# EAGLE design Low_Voltage_Solar_Controller_V1.1 (EAGLE 9.6.2)
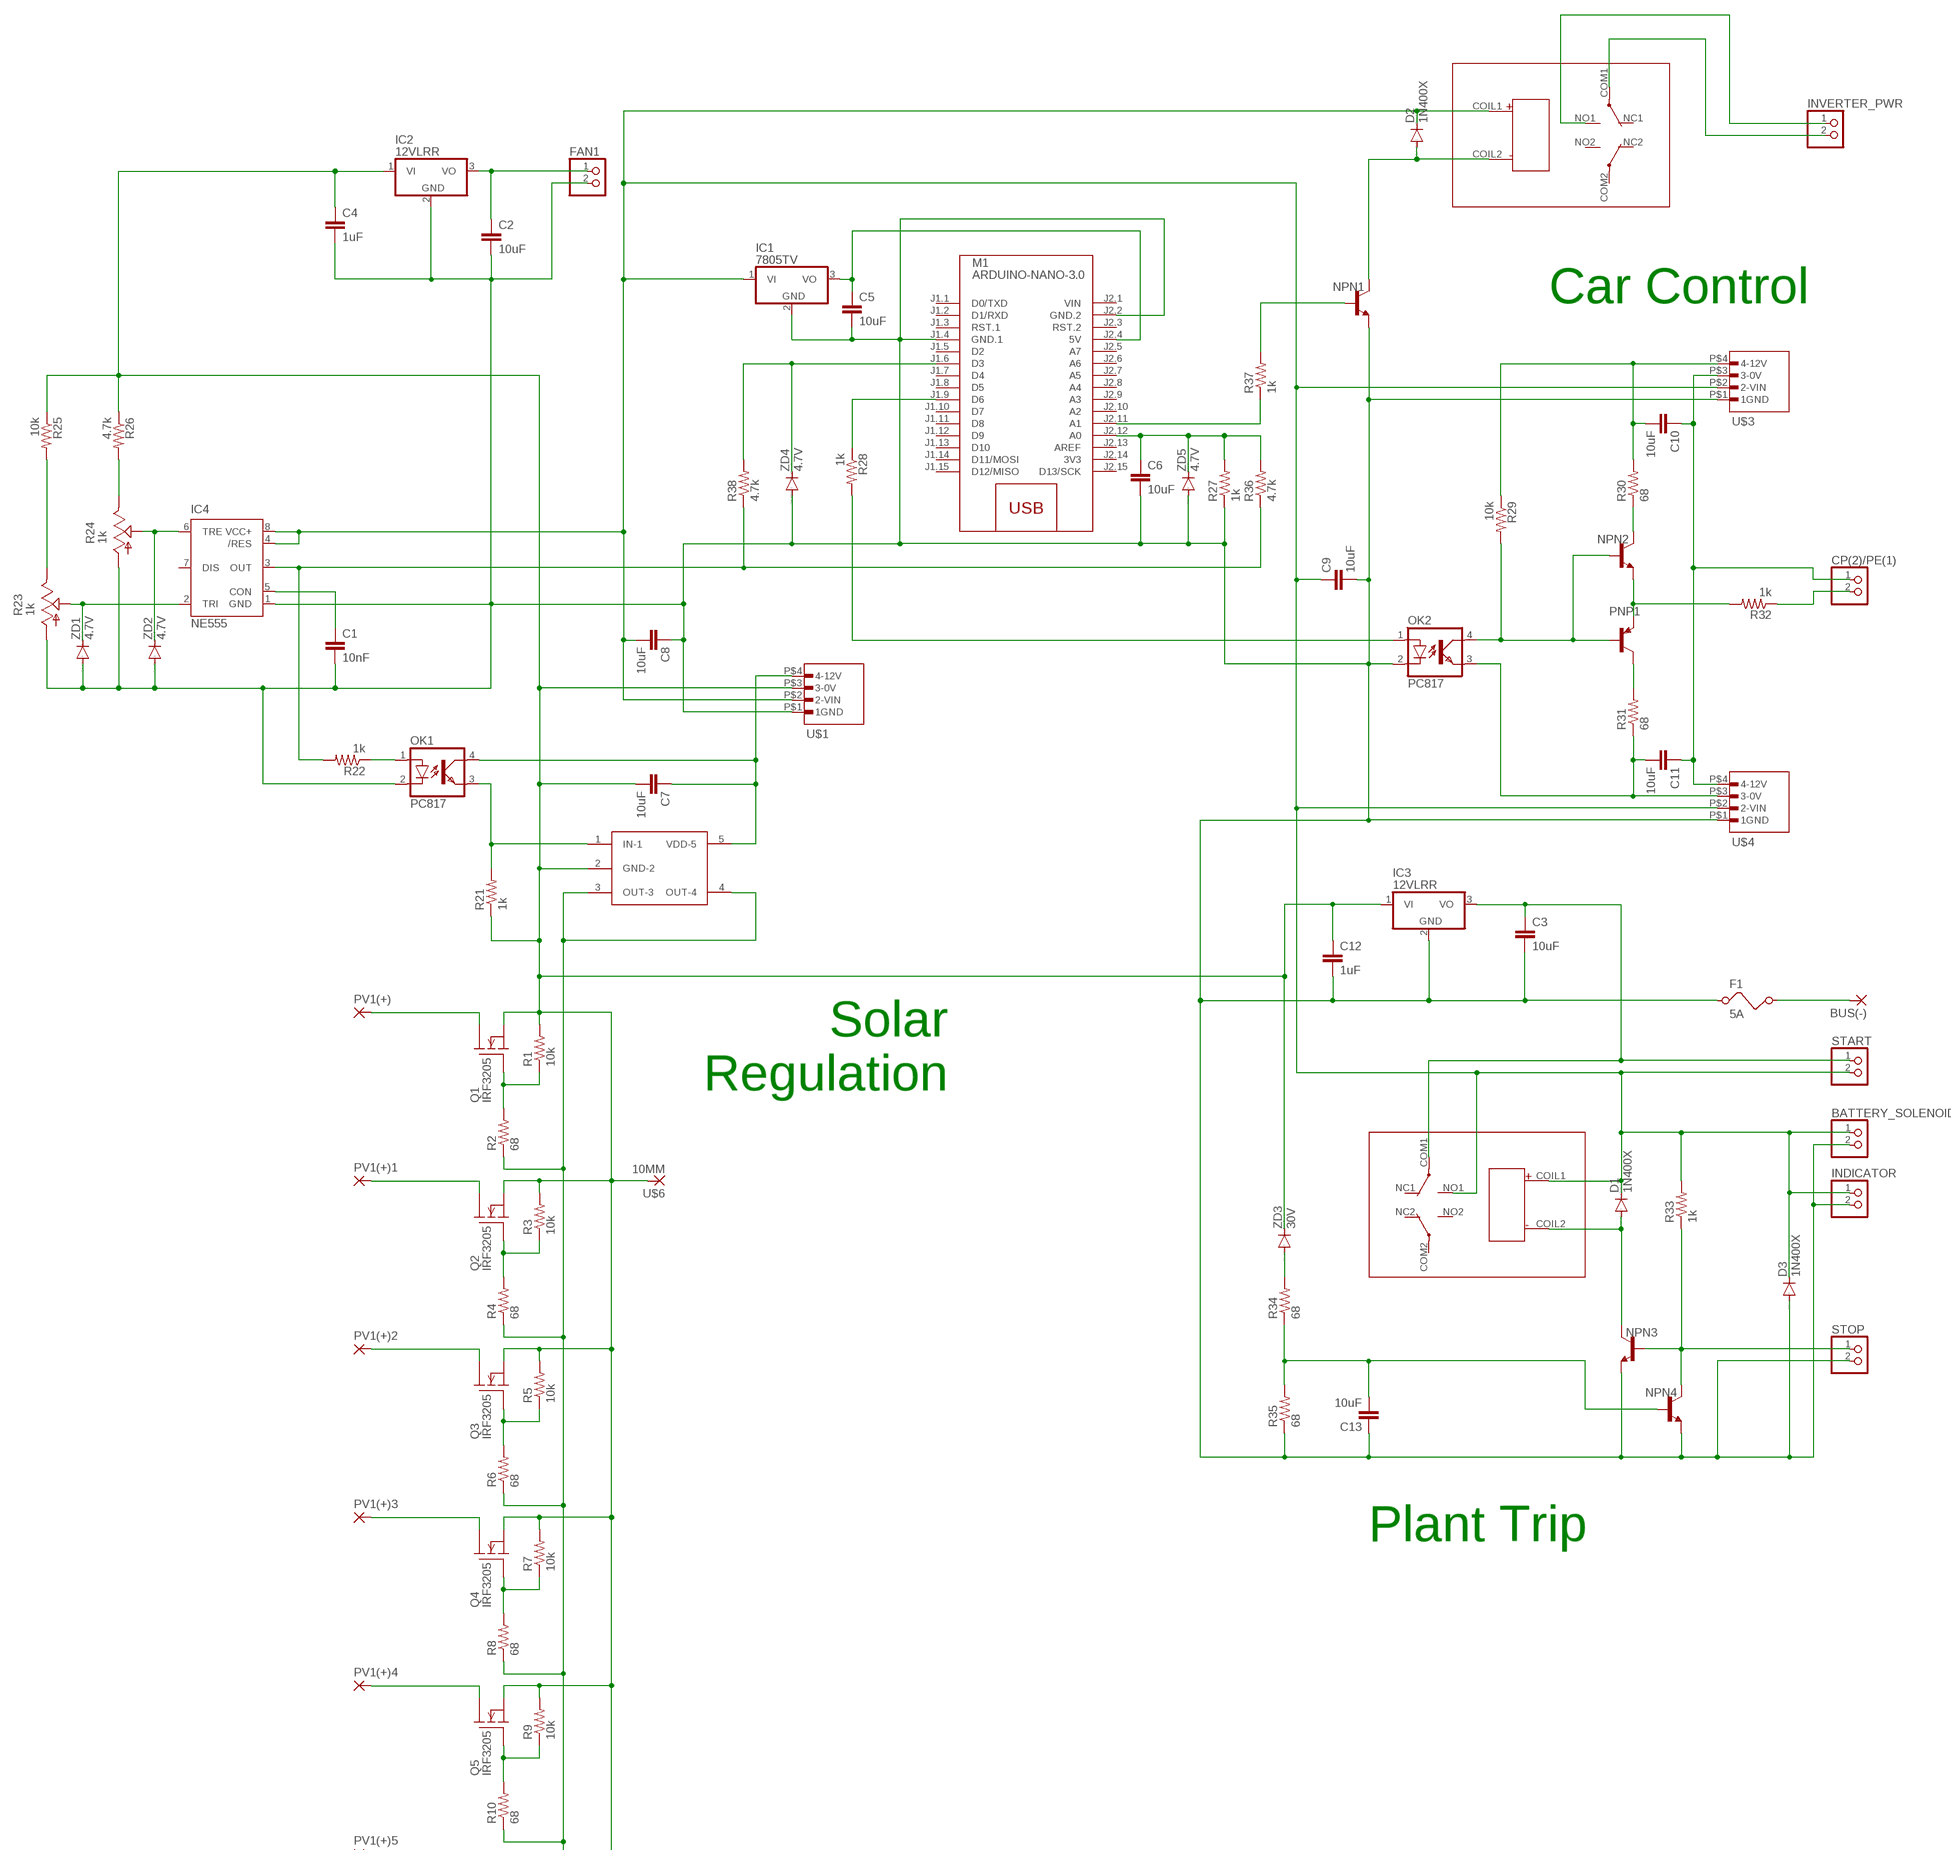
[diagram p0: schematic, sheet 1, part 1 of 2]
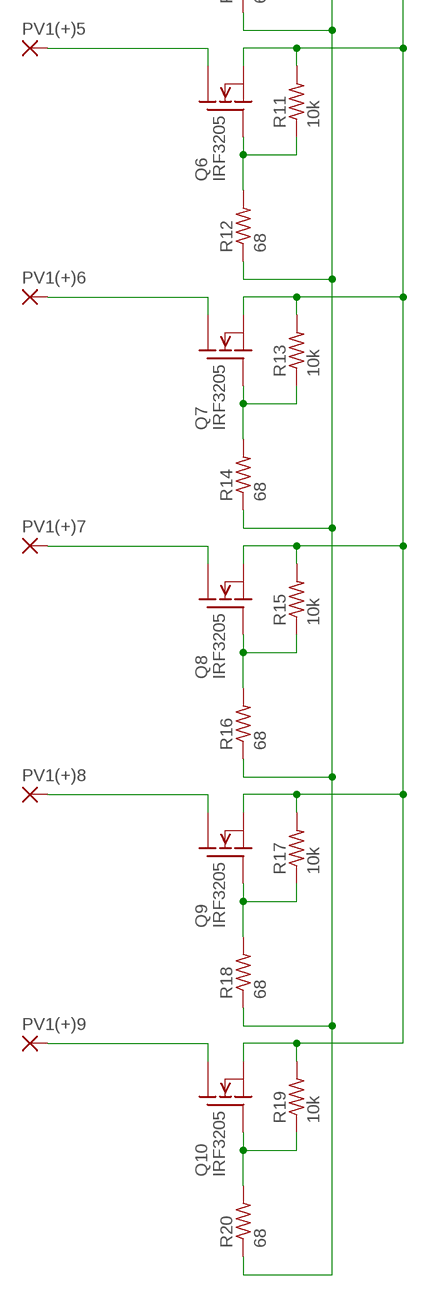
[diagram p1: schematic, sheet 1, part 2 of 2]

## Parts
BATTERY_SOLENOID  PINHD-1X2  [1X02]
BUS(-)  5MM_PAD  [5MM]
C1  10nF  C-EUC0603  [C0603]
C2  10uF  C-EUC0805  [C0805]
C3  10uF  C-EUC0805  [C0805]
C4  1uF  C-EUC0805  [C0805]
C5  10uF  C-EUC0805  [C0805]
C6  10uF  C-EUC0805  [C0805]
C7  10uF  C-EUC0805  [C0805]
C8  10uF  C-EUC0805  [C0805]
C9  10uF  C-EUC0805  [C0805]
C10  10uF  C-EUC0805  [C0805]
C11  10uF  C-EUC0805  [C0805]
C12  1uF  C-EUC0805  [C0805]
C13  10uF  C-EUC0805  [C0805]
CP(2)/PE(1)  PINHD-1X2  [1X02]
D1  1N400X  1N4004  [DO41-10]
D2  1N400X  1N4004  [DO41-10]
D3  1N400X  1N4004  [DO41-10]
F1  5A  FUSE_HOLDER  [FUSE_HOLDER]
FAN1  PINHD-1X2  [1X02]
IC1  7805TV  [TO220V]
IC2  12VLRR  7805TV  [TO220V]
IC3  12VLRR  7805TV  [TO220V]
IC4  NE555  [DIL-08]
INDICATOR  PINHD-1X2  [1X02]
INVERTER_PWR  PINHD-1X2  [1X02]
M1  ARDUINO-NANO-3.0  [ARDUINO-NANO-3.0]
NPN1  -NPN-TO92-EBC  [TO92-EBC]
NPN2  -NPN-TO92-EBC  [TO92-EBC]
NPN3  -NPN-TO92-EBC  [TO92-EBC]
NPN4  -NPN-TO92-EBC  [TO92-EBC]
OK1  PC817  [DIL04]
OK2  PC817  [DIL04]
PNP1  BCX58-PNP-TO92-EBC  [TO92-EBC]
PV1(+)  5MM_PAD  [5MM]
PV1(+)1  5MM_PAD  [5MM]
PV1(+)2  5MM_PAD  [5MM]
PV1(+)3  5MM_PAD  [5MM]
PV1(+)4  5MM_PAD  [5MM]
PV1(+)5  5MM_PAD  [5MM]
PV1(+)6  5MM_PAD  [5MM]
PV1(+)7  5MM_PAD  [5MM]
PV1(+)8  5MM_PAD  [5MM]
PV1(+)9  5MM_PAD  [5MM]
Q1  IRF3205  BUZ11  [TO220]
Q2  IRF3205  BUZ11  [TO220]
Q3  IRF3205  BUZ11  [TO220]
Q4  IRF3205  BUZ11  [TO220]
Q5  IRF3205  BUZ11  [TO220]
Q6  IRF3205  BUZ11  [TO220]
Q7  IRF3205  BUZ11  [TO220]
Q8  IRF3205  BUZ11  [TO220]
Q9  IRF3205  BUZ11  [TO220]
Q10  IRF3205  BUZ11  [TO220]
R1  10k  R-US_R0805  [R0805]
R2  68  R-US_R0805  [R0805]
R3  10k  R-US_R0805  [R0805]
R4  68  R-US_R0805  [R0805]
R5  10k  R-US_R0805  [R0805]
R6  68  R-US_R0805  [R0805]
R7  10k  R-US_R0805  [R0805]
R8  68  R-US_R0805  [R0805]
R9  10k  R-US_R0805  [R0805]
R10  68  R-US_R0805  [R0805]
R11  10k  R-US_R0805  [R0805]
R12  68  R-US_R0805  [R0805]
R13  10k  R-US_R0805  [R0805]
R14  68  R-US_R0805  [R0805]
R15  10k  R-US_R0805  [R0805]
R16  68  R-US_R0805  [R0805]
R17  10k  R-US_R0805  [R0805]
R18  68  R-US_R0805  [R0805]
R19  10k  R-US_R0805  [R0805]
R20  68  R-US_R0805  [R0805]
R21  1k  R-US_R0805  [R0805]
R22  1k  R-US_R0805  [R0805]
R23  1k  TRIM_US-RJ9W  [RJ9W]
R24  1k  TRIM_US-RJ9W  [RJ9W]
R25  10k  R-US_R0805  [R0805]
R26  4.7k  R-US_R0805  [R0805]
R27  1k  R-US_R0805  [R0805]
R28  1k  R-US_R0805  [R0805]
R29  10k  R-US_R0805  [R0805]
R30  68  R-US_R0805  [R0805]
R31  68  R-US_R0805  [R0805]
R32  1k  R-US_R0805  [R0805]
R33  1k  R-US_R0805  [R0805]
R34  68  R-US_R0805  [R0805]
R35  68  R-US_R0805  [R0805]
R36  4.7k  R-US_R0805  [R0805]
R37  1k  R-US_R0805  [R0805]
R38  4.7k  R-US_R0805  [R0805]
START  PINHD-1X2  [1X02]
STOP  PINHD-1X2  [1X02]
U$1  IB0512S-W75R3  [IB0512S-W75R3]
U$2  NCP51100  [SOT23-5]
U$3  IB0512S-W75R3  [IB0512S-W75R3]
U$4  IB0512S-W75R3  [IB0512S-W75R3]
U$5  J104D2C12VDC.20S  [J104D2C12VDC.20S]
U$6  10MM  [10MM]
U$8  J104D2C12VDC.20S  [J104D2C12VDC.20S]
ZD1  4.7V  CGRM4001-G  [SOD-123_MINI-SMA]
ZD2  4.7V  CGRM4001-G  [SOD-123_MINI-SMA]
ZD3  30V  DIODE-DO214AA  [DO214AA]
ZD4  4.7V  CGRM4001-G  [SOD-123_MINI-SMA]
ZD5  4.7V  CGRM4001-G  [SOD-123_MINI-SMA]

## Nets
N$1: PV1(+).P$1(P) Q1.2(D)
N$2: C4.1 C7.2 C12.1 IC2.1(VI) IC3.1(VI) Q1.3(S) Q2.3(S) Q3.3(S) Q4.3(S) Q5.3(S) Q6.3(S) Q7.3(S) Q8.3(S) Q9.3(S) Q10.3(S) R1.2 R3.2 R5.2 R7.2 R9.2 R11.2 R13.2 R15.2 R17.2 R19.2 R21.1 R25.1 R26.1 U$1.P$3(3-0V) U$2.2(GND-2) U$6.P$1(P) ZD3.C
N$3: Q1.1(G) R1.1 R2.2
N$4: PV1(+)1.P$1(P) Q2.2(D)
N$5: M1.J1.6(D3) R38.2 ZD4.C
N$6: Q2.1(G) R3.1 R4.2
N$7: PV1(+)2.P$1(P) Q3.2(D)
N$9: Q3.1(G) R5.1 R6.2
N$10: PV1(+)3.P$1(P) Q4.2(D)
N$12: C5.1 IC1.3(VO) M1.J2.4(5V)
N$13: Q4.1(G) R7.1 R8.2
N$14: PV1(+)4.P$1(P) Q5.2(D)
N$16: Q5.1(G) R9.1 R10.2
N$17: PV1(+)5.P$1(P) Q6.2(D)
N$19: Q6.1(G) R11.1 R12.2
N$20: PV1(+)6.P$1(P) Q7.2(D)
N$22: Q7.1(G) R13.1 R14.2
N$23: PV1(+)7.P$1(P) Q8.2(D)
N$25: Q8.1(G) R15.1 R16.2
N$26: PV1(+)8.P$1(P) Q9.2(D)
N$28: Q9.1(G) R17.1 R18.2
N$29: PV1(+)9.P$1(P) Q10.2(D)
N$31: Q10.1(G) R19.1 R20.2
N$32: R2.1 R4.1 R6.1 R8.1 R10.1 R12.1 R14.1 R16.1 R18.1 R20.1 U$2.3(OUT-3) U$2.4(OUT-4)
N$33: OK1.3(EMIT) R21.2 U$2.1(IN-1)
N$34: C7.1 OK1.4(COL) U$1.P$4(4-12V) U$2.5(VDD-5)
N$36: BATTERY_SOLENOID.1 C8.2 C9.1 D1.C D2.C D3.C IC1.1(VI) IC4.4(/RES) IC4.8(VCC+) INDICATOR.1 R33.2 START.2 U$1.P$2(2-VIN) U$3.P$2(2-VIN) U$4.P$2(2-VIN) U$5.COIL1 U$8.COIL1 U$8.NO1
N$37: OK1.1(A) R22.1
N$38: BATTERY_SOLENOID.2 C1.2 C2.2 C3.2 C4.2 C5.2 C6.2 C8.1 C9.2 C12.2 C13.1 D3.A F1.P$1 F1.P$2 FAN1.2 IC1.2(GND) IC2.2(GND) IC3.2(GND) IC4.1(GND) INDICATOR.2 M1.J1.4(GND.1) M1.J2.2(GND.2) NPN1.E NPN3.E NPN4.E OK1.2(C) OK2.2(C) R23.A R24.A R27.1 R35.1 STOP.2 U$1.P$1(1GND) U$3.P$1(1GND) U$4.P$1(1GND) ZD1.A ZD2.A ZD4.A ZD5.A
N$39: C1.1 IC4.5(CON)
N$40: C2.1 FAN1.1 IC2.3(VO)
N$41: IC4.6(TRE) R24.S ZD2.C
N$42: IC4.2(TRI) R23.S ZD1.C
N$43: R23.E R25.2
N$44: R24.E R26.2
N$45: C6.1 M1.J2.12(A0) R27.2 R36.2 ZD5.C
N$46: M1.J1.9(D6) R28.1
N$47: OK2.1(A) R28.2
N$48: NPN2.B OK2.4(COL) PNP1.B R29.2
N$49: C10.1 C11.1 CP(2)/PE(1).1 U$3.P$3(3-0V) U$4.P$4(4-12V)
N$50: C11.2 OK2.3(EMIT) R31.1 U$4.P$3(3-0V)
N$51: C10.2 R29.1 R30.2 U$3.P$4(4-12V)
N$52: NPN2.E PNP1.E R32.2
N$53: PNP1.C R31.2
N$54: NPN2.C R30.1
N$55: CP(2)/PE(1).2 R32.1
N$56: BUS(-).P$1(P) F1.P$3 F1.P$4
N$57: D1.A NPN3.C U$8.COIL2
N$58: NPN3.B NPN4.C R33.1 STOP.1
N$59: C13.2 NPN4.B R34.1 R35.2
N$60: R34.2 ZD3.A
N$61: C3.1 IC3.3(VO) START.1 U$8.COM1
N$62: M1.J2.11(A1) R37.1
N$63: IC4.3(OUT) R22.2 R36.1 R38.1
N$64: NPN1.B R37.2
N$65: D2.A NPN1.C U$5.COIL2
N$66: INVERTER_PWR.2 U$5.COM1
N$67: INVERTER_PWR.1 U$5.NO1
Unconnected: IC4.7(DIS) M1.J1.1(D0/TXD) M1.J1.2(D1/RXD) M1.J1.3(RST.1) M1.J1.5(D2) M1.J1.7(D4) M1.J1.8(D5) M1.J1.10(D7) M1.J1.11(D8) M1.J1.12(D9) M1.J1.13(D10) M1.J1.14(D11/MOSI) M1.J1.15(D12/MISO) M1.J2.3(RST.2) M1.J2.5(A7) M1.J2.6(A6) M1.J2.7(A5) M1.J2.8(A4) M1.J2.9(A3) M1.J2.10(A2) M1.J2.13(AREF) M1.J2.15(D13/SCK) U$5.COM2 U$5.NC1 U$5.NC2 U$5.NO2 U$8.COM2 U$8.NC1 U$8.NC2 U$8.NO2

## Notes on the sheet
- Car Control
- Solar
  Regulation
- Plant Trip

## Power pins joined to a net without a drawn wire
3V3: M1.J2.14(3V3)
VIN: M1.J2.1(VIN)

## Library data of the parts
BATTERY_SOLENOID CP(2)/PE(1) FAN1 INDICATOR INVERTER_PWR START STOP = pinhead:PINHD-1X2: PIN HEADER
BUS(-) PV1(+) PV1(+)1-PV1(+)9 = Tesla_Inverter_Parts:5MM_PAD
C1-C13 = resistor:C-EU: CAPACITOR, European symbol
D1-D3 = diode:1N4004: DIODE general purpose rectifier, 1 A
F1 = Opa_LED_Controller_Parts:FUSE_HOLDER
IC1-IC3 = linear:78*: Positive VOLTAGE REGULATOR Source: http://cache.national.com/ds/LM/LM78L05.pdf http://www.fairchildsemi.com/ds/LM/LM7805.pdf
IC4 = st-microelectronics:NE555: General purpose bipolar Timer; MF: Arrow Electronics; MPN: NE555N; OC_FARNELL: 1467742; OC_NEWARK: 89K1486
M1 = diy-modules:ARDUINO-NANO-3.0: Arduino Nano 3.0
NPN1-NPN4 = transistor-neu-to92:*-NPN-: NPN Transistror
OK1 OK2 = optocoupler:PC817: SHARP OPTO COUPLER; MPN: PC817X4J000F; OC_FARNELL: 9707727; OC_NEWARK: 97K7059
PNP1 = transistor:*-PNP-: PNP Transistror
Q1-Q10 = transistor-fet:BUZ11: N-Channel Enhancement MOSFET 50V; 30A; 0,040Ohm
R1-R22 R25-R38 = resistor:R-US_: RESISTOR, American symbol
R23 R24 = pot:TRIM_US-: POTENTIOMETER
U$1 U$3 U$4 = Tesla_Inverter_Parts:IB0512S-W75R3
U$2 = Tesla_Inverter_Parts:NCP51100
U$5 U$8 = Beach_Bags_Parts:J104D2C12VDC.20S
U$6 = Tesla_Inverter_Parts:10MM
ZD1 ZD2 ZD4 ZD5 = diode:CGRM400*-G: Molded plasitc,JEDEC SOD-123/Mini SMA Source: Comchip CGRM4001-G.pdf
ZD3 = diode:DIODE-: DIODE

## Board
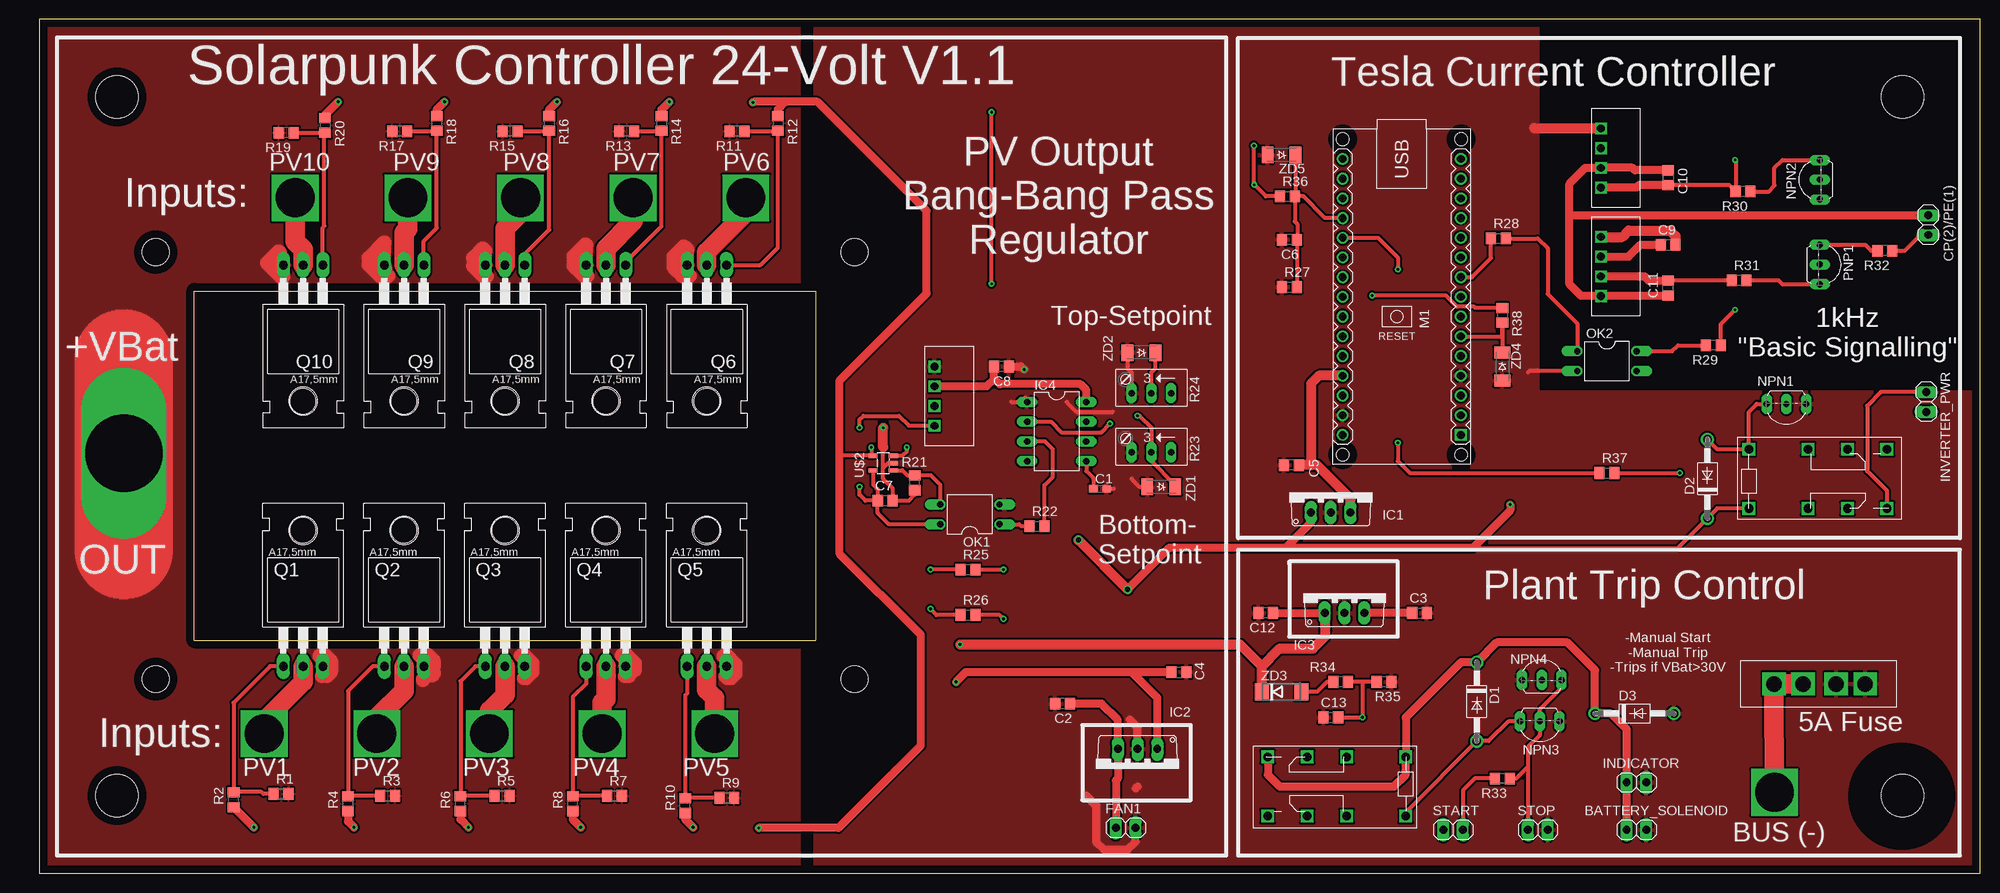
[diagram p2: board, top side]
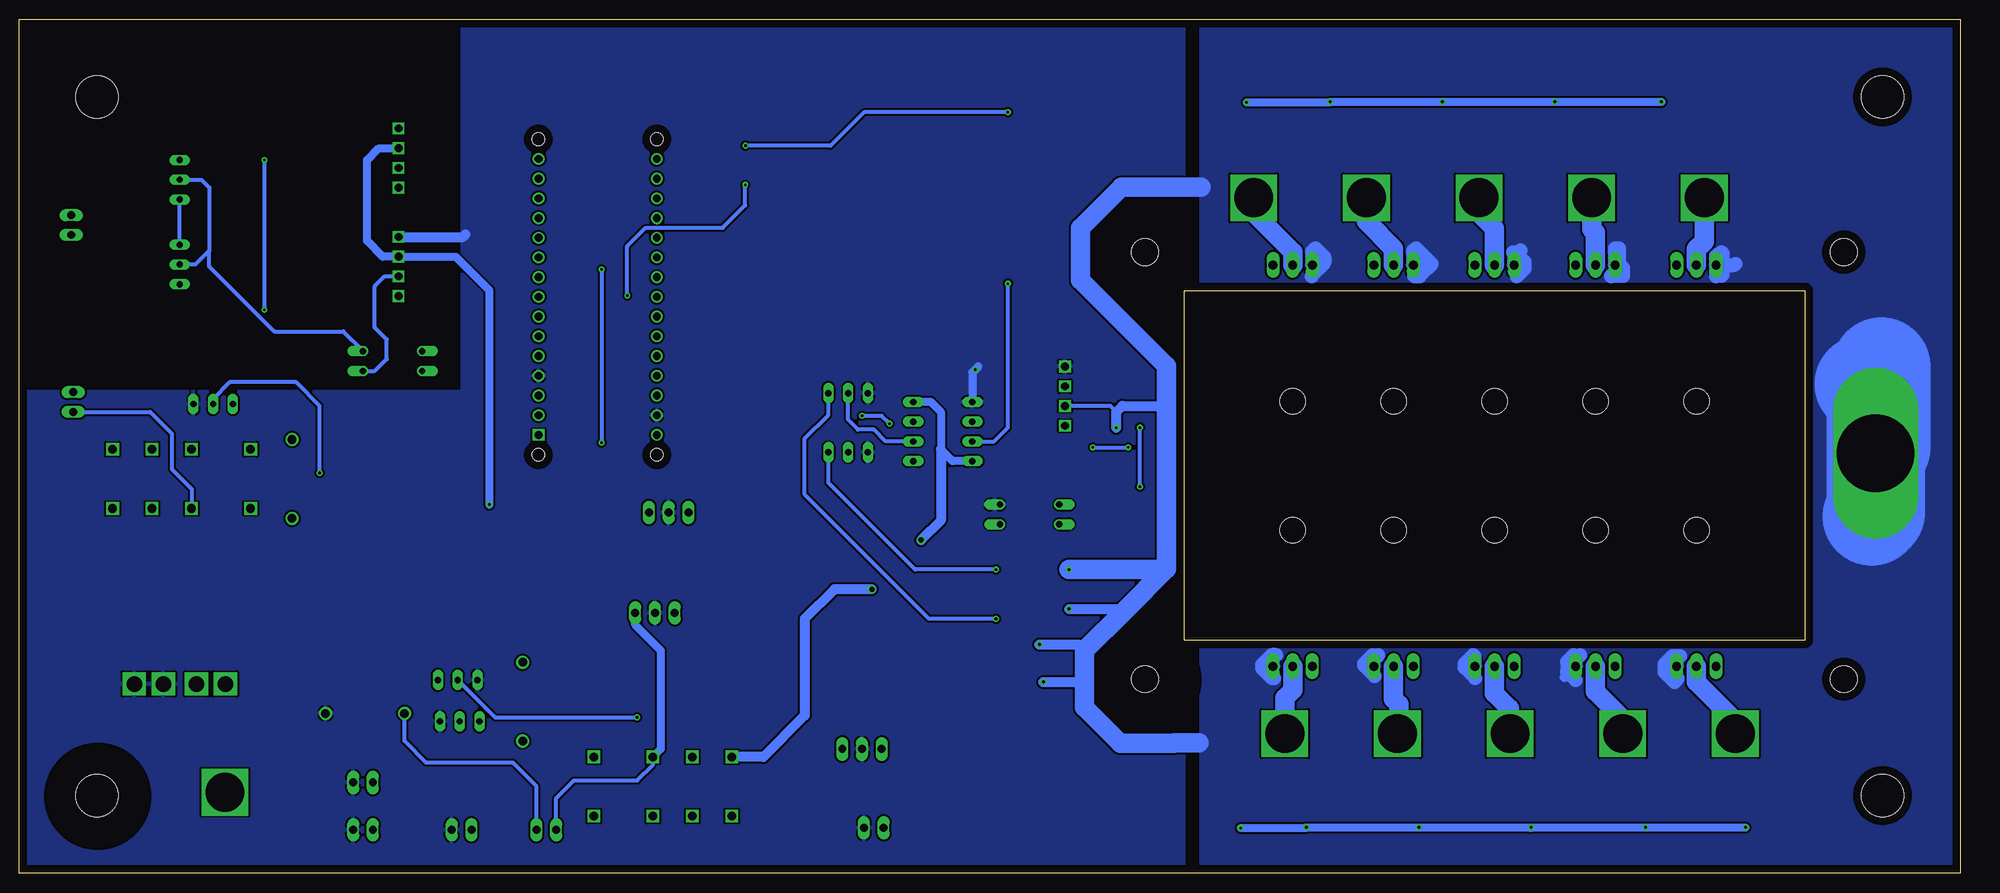
[diagram p3: board, bottom side, seen from below]

Size 250 x 110 mm. Coordinates in mm from the lower left corner, seen from the top.
Outline: 0,0 250,0 250,110 0,110 0,0
Outline: 20,30 100,30 100,75 20,75 20,30
Copper layers (1*16): Top 0.035mm / dielectric 1.5mm / Bottom 0.035mm
Design rules "default *": minimum track width 6mil, minimum drill 0.35mm, track to track 10mil, track to pad 10mil, pad to pad 10mil, via to via 10mil, smd to smd 6mil, copper to edge 40mil, drill to drill 6mil, minimum pad ring 10mil, minimum via ring 8mil, stop-mask expansion 4mil, vias tented up to drill 0mil, thermal gap 10mil
Holes 3.5 mm at 15,80 105,80 15,25 105,25
Holes 5.5 mm at 10,10 240,10 240,100 10,100
tRestrict: area 233.3,3.3 to 246.5,16.5; area 233.3,93.3 to 246.5,106.5
bRestrict: area 233.3,3.3 to 246.5,16.5; area 233.6,93.3 to 246.9,106.5; area 98.5,73.1 to 111.8,86.4; area 98,18.3 to 111.3,31.5

### Footprints (pad centres in the part's own frame; a part is rotated, then mirrored left to right if it is on the bottom)
1X02 = drill 1.016 long: 1 -1.27,0; 2 1.27,0
5MM = drill 5 square: P$1 0,0
C0603 = smd 1.1 x 1: 1 -0.85,0; 2 0.85,0
C0805 = smd 1.3 x 1.5: 1 -0.95,0; 2 0.95,0
DO41-10 = drill 1.118: A 5.08,0; C -5.08,0
FUSE_HOLDER = drill 2 square: P$1 0,0; P$2 3.75,0; P$3 8,0; P$4 11.75,0
TO220V = drill 1.016 long: 1 -2.54,-2.54; 2 0,-2.54; 3 2.54,-2.54
DIL-08 = drill 0.813 long: 1 -3.81,-3.81; 2 -1.27,-3.81; 3 1.27,-3.81; 4 3.81,-3.81; 5 3.81,3.81; 6 1.27,3.81; 7 -1.27,3.81; 8 -3.81,3.81
ARDUINO-NANO-3.0 = drill 1 square: J1.1 17.78,7.62 | drill 1: J1.2 15.24,7.62; J1.3 12.7,7.62; J1.4 10.16,7.62; J1.5 7.62,7.62; J1.6 5.08,7.62; J1.7 2.54,7.62; J1.8 0,7.62; J1.9 -2.54,7.62; J1.10 -5.08,7.62; J1.11 -7.62,7.62; J1.12 -10.16,7.62; J1.13 -12.7,7.62; J1.14 -15.24,7.62; J1.15 -17.78,7.62; J2.1 17.78,-7.62; J2.2 15.24,-7.62; J2.3 12.7,-7.62; J2.4 10.16,-7.62; J2.5 7.62,-7.62; J2.6 5.08,-7.62; J2.7 2.54,-7.62; J2.8 0,-7.62; J2.9 -2.54,-7.62; J2.10 -5.08,-7.62; J2.11 -7.62,-7.62; J2.12 -10.16,-7.62; J2.13 -12.7,-7.62; J2.14 -15.24,-7.62; J2.15 -17.78,-7.62 | hole 1.651: -20.32,7.62; -20.32,-7.62; 20.32,-7.62; 20.32,7.62
TO92-EBC = drill 0.813 long: B 0,-1.27; C 2.54,-1.27; E -2.54,-1.27
DIL04 = drill 0.813 offset: 1 -1.27,-3.81; 2 1.27,-3.81; 3 1.27,3.81; 4 -1.27,3.81
TO220 = drill 1.118 long: 1 -2.54,-6.35; 2 0,-6.35; 3 2.54,-6.35 | hole 3.302: 0,11.176
R0805 = smd 1.3 x 1.5: 1 -0.95,0; 2 0.95,0
RJ9W = drill 0.813 long: A 2.54,0.635; E -2.54,0.635; S 0,0.635
IB0512S-W75R3 = drill 1 square: P$1 0,0; P$2 2.54,0; P$3 5.08,0; P$4 7.62,0
SOT23-5 = smd 0.55 x 1.2: 1 -0.95,-1.3; 2 0,-1.3; 3 0.95,-1.3; 4 0.95,1.3; 5 -0.95,1.3
J104D2C12VDC.20S = drill 1.1 square: COIL1 0,0; COIL2 0,7.62; COM1 7.62,0; COM2 7.62,7.62; NC1 12.7,0; NC2 12.7,7.62; NO1 17.78,0; NO2 17.78,7.62
10MM = drill 10 long: P$1 0,0
SOD-123_MINI-SMA = smd 1.5 x 2.1: A 1.8,0; C -1.8,0
DO214AA = smd 1.8 x 2.2: A 2.55,0; C -2.55,0

### Placement (x,y rotation side)
BATTERY_SOLENOID  205.74,5.59 0 top
BUS(-)  223.52,10.41 0 top
C1  136.65,49.53 0 top
C2  131.83,21.84 180 top
C3  177.8,33.53 0 top
C4  146.81,25.91 0 top
C5  161.29,52.58 180 top
C6  161.04,81.61 180 top
C7  108.97,48.01 0 top
C8  123.95,65.28 180 top
C9  209.8,80.96 0 top
C10  209.8,89.6 270 top
C11  209.8,75.37 90 top
C12  157.99,33.53 180 top
C13  166.37,20.07 0 top
CP(2)/PE(1)  243.33,83.5 270 top
D1  185.17,22.1 270 top
D2  214.88,50.8 90 top
D3  205.49,20.57 0 top
F1  235.2,24.38 180 top
FAN1  139.95,5.84 0 top
IC1  166.37,49.02 0 top
IC2  141.48,13.46 180 top
IC3  168.15,36.07 0 top
IC4  131.06,56.9 270 top
INDICATOR  205.74,11.68 0 top
INVERTER_PWR  243.08,60.71 270 top
M1  175.51,74.25 270 top
NPN1  225.04,59.18 180 top
NPN2  228.09,89.34 90 top
NPN3  193.29,18.29 180 top
NPN4  193.55,26.16 0 top
OK1  119.89,46.23 90 top
OK2  201.93,65.98 270 top
PNP1  230.63,78.42 270 top
PV1(+)  28.98,17.98 0 top
PV1(+)1  43.49,17.98 0 top
PV1(+)2  58,17.98 0 top
PV1(+)3  72.51,17.98 0 top
PV1(+)4  87.02,17.98 0 top
PV1(+)5  91.02,87.02 0 top
PV1(+)6  76.51,87.02 0 top
PV1(+)7  62,87.02 0 top
PV1(+)8  47.49,87.02 0 top
PV1(+)9  32.98,87.02 0 top
Q1  34,33 0 top
Q2  47,33 0 top
Q3  60,33 0 top
Q4  73,33 0 top
Q5  86,33 0 top
Q6  86,72 180 top
Q7  73,72 180 top
Q8  60,72 180 top
Q9  47,72 180 top
Q10  34,72 180 top
R1  31.16,10.22 0 top
R2  25.05,9.46 90 top
R3  44.9,9.97 0 top
R4  39.78,8.95 90 top
R5  59.63,9.97 0 top
R6  54.26,8.95 90 top
R7  74.11,9.97 0 top
R8  68.74,8.95 90 top
R9  88.58,9.72 0 top
R10  83.22,8.7 90 top
R11  89.88,95.58 180 top
R12  95.16,96.6 270 top
R13  75.66,95.58 180 top
R14  80.17,96.6 270 top
R15  60.67,95.58 180 top
R16  65.69,96.6 270 top
R17  46.45,95.58 180 top
R18  51.21,96.6 270 top
R19  31.83,95.39 180 top
R20  36.83,96.35 270 top
R21  112.78,50.29 90 top
R22  128.52,44.7 0 top
R23  143.26,54.86 180 top
R24  143.26,62.48 180 top
R25  119.63,39.12 0 top
R26  119.63,33.27 0 top
R27  161.04,75.52 0 top
R28  187.96,81.79 0 top
R29  215.65,68.01 180 top
R30  219.46,87.82 180 top
R31  218.95,76.39 0 top
R32  237.74,80.2 180 top
R33  188.47,12.19 180 top
R34  167.64,24.64 180 top
R35  173.23,24.64 180 top
R36  160.78,87.2 0 top
R37  201.93,51.56 0 top
R38  188.47,71.88 270 top
START  182.12,5.59 0 top
STOP  193.04,5.59 0 top
U$1  115.32,65.28 270 top
U$2  108.71,52.83 90 top
U$3  201.17,95.95 270 top
U$4  201.17,81.98 270 top
U$5  220.22,46.99 0 top
U$6  10.92,54.1 90 top
U$8  176.02,14.99 180 top
ZD1  144.53,49.78 180 top
ZD2  141.99,67.06 180 top
ZD3  160.02,23.37 0 top
ZD4  188.47,65.28 270 top
ZD5  160.02,92.54 180 top

### Tracks (layer width: path | path; a pad name or v marks a point on that pad's centre or on a via)
N$1
  Top 2.54: Q1.2 34,24.62 28.98,19.6 PV1(+).P$1
  Bottom 2.54: Q1.2 34,24.62 29.12,19.73 29.12,18.72
N$2  (via drill 0.35)
  Top 0.508: 60.64,10.04 R5.2 | Q2.3 49.63,26.65 50.49,25.79 | U$2.2 109.37,52.83 108.71,52.17 | 108.71,52.17 108.71,50.8 109.92,49.6 C7.2 112.01,48.01 112.78,48.77 R21.1 | 108.71,52.17 108.71,54.86 | R25.1 v114.81,39.12 | R26.1 115.57,33.27 v114.81,34.04
  Top 1.016: IC2.1 144.02,22.61 140.72,25.91 | 140.72,25.91 119.38,25.91 v118.11,24.64 | 140.72,25.91 C4.1 | C12.1 IC3.1
  Top 1.27: IC3.1 165.61,30.48 164.08,28.96 159.76,28.96 157.47,26.67 | ZD3.C 157.47,26.67 | 157.47,26.67 154.68,29.46 v118.62,29.46 | 108.71,54.86 v108.71,57.4
  Top 1.778: Q10.3 30.99,78.82 30.99,79.98 30.85,80.12 29.34,78.61 31.05,76.91 31.44,76.91 31.5,76.96 | Q9.3 44.46,81.27 44.45,81.28 42.42,79.25 42.42,78.43 43.94,76.91 44.9,76.91 44.96,76.96 44.96,76.98 44.59,77.35 44.59,77.84 43.43,78.99 | Q8.3 57.46,80.21 57.15,80.52 55.88,79.25 55.88,78.23 57.21,76.91 57.66,76.91 | Q7.3 70.46,80.92 70.36,81.03 68.83,79.5 68.83,78.23 70.1,76.96 70.61,76.96 | Q6.3 83.46,80.37 83.06,80.77 81.66,79.38 81.66,78.11 82.8,76.96 83.82,76.96 | Q1.3 36.54,27.52 36.09,27.97 36.22,28.09 36.83,28.09 37.59,27.33 37.59,25.91 37.08,25.4 36.41,25.4 | Q2.3 49.54,27.52 48.98,28.08 48.99,28.09 50.14,28.09 50.8,27.43 50.8,26.42 49.41,25.03 49.41,24.89 | Q3.3 62.54,27.52 62.05,28.01 62.13,28.09 62.48,28.09 63.5,27.08 63.5,25.91 62.74,25.15 62.41,25.15 | Q4.3 75.54,27.52 75.03,28.04 75.08,28.09 75.69,28.09 76.71,27.08 76.71,26.16 75.95,25.4 75.44,25.4 | Q5.3 88.54,27.54 88.14,27.94 88.29,28.09 88.52,28.09 89.66,26.95 89.66,25.65 89.15,25.15 88.67,25.15 88.41,25.4
  Top 12.7: 10.92,66.29 U$6.P$1 10.92,41.66
  Top 2.54: 50.49,25.79 49.94,26.34
  Bottom 0.508: U$1.P$3 109.47,60.2 108.71,59.44 | v118.62,29.46 112.52,29.46
  Bottom 1.016: v118.11,24.64 117.86,24.64
  Bottom 1.27: Q2.3 49.63,26.65 51,25.28 | v118.11,24.64 112.8,24.64 | 112.8,28.68 113.58,29.46 v118.62,29.46 | v114.81,34.04 107.7,34.04 107.57,33.91 | v108.71,57.4 108.71,59.44 107.95,60.2 102.29,60.2
  Bottom 1.778: Q10.3 29.09,78.35 28.96,78.49 | Q10.3 31.46,77.69 30.73,76.96 30.61,77.09 30.61,79.88 30.73,80.01 | Q9.3 43.94,78.87 43.94,80.52 | Q9.3 44.45,76.96 43.43,76.96 43.43,77.98 | Q8.3 57.46,79.45 56.64,80.26 | Q8.3 57.03,78.35 56.39,78.99 56.13,78.74 56.13,77.92 57.15,76.91 | Q8.3 57.46,79.81 57.59,79.94 57.59,80.01 | Q7.3 70.46,80.16 70.1,80.52 68.07,78.49 69.65,76.91 69.85,76.91 | 69.85,76.91 69.85,77.98 | 69.85,76.91 70.3,76.91 70.36,76.96 | Q6.3 83.46,80.12 83.06,80.52 81.92,79.38 81.92,78.61 83.57,76.96 83.57,76.91 | 36.41,25.15 36.41,25.05 36.83,24.64 38.1,25.91 38.1,26.92 37.08,27.94 36.58,27.94 36.58,26.69 Q1.3 36.54,27.52 36.09,27.97 | 49.53,24.89 50.62,25.98 50.62,27.26 49.78,28.09 49.54,27.85 Q2.3 49.54,27.52 48.98,28.08 | Q3.3 62.54,27.9 62.74,28.09 63.83,27 63.83,26.49 62.48,25.15 | 75.44,25.4 76.78,26.75 76.78,27 75.69,28.09 75.54,27.94 Q4.3 75.54,27.52 74.98,28.08 | Q5.3 88.54,27.69 88.14,28.09 88.69,28.09 89.92,26.88 89.92,26.42 88.65,25.15 88.41,25.15 | Q10.3 31.46,79.51 31.23,79.74 | Q10.3 31.5,78.31 31.5,76.91 | Q9.3 44.46,77.48 45.02,76.92 | Q9.3 44.46,80.51 44.45,80.52
  Bottom 12.7: U$6.P$1 10.16,54.86 10.16,65.28 | U$6.P$1 10.92,46.48 11.43,45.97 | U$6.P$1 10.92,61.47 12.45,62.99
  Bottom 2.54: 97.79,88.39 108.04,88.39 113.3,83.13 113.3,76.38 102.29,65.36 102.29,60.2 102.29,39.19 102.36,39.12 | 98.04,16.76 101.25,16.76 101.27,16.74 108.18,16.74 112.8,21.36 112.8,24.64 112.8,28.68 107.57,33.91 102.36,39.12 | v114.81,39.12 102.36,39.12
  pour Bottom: 0,110 98,110 98,47 98,0 87,0 0,0
  pour Top: 0,110 98,110 98,0 0,0
N$3
  Top 0.508: Q1.1 29.73,26.65 25.05,21.97 25.05,10.48 | 25.05,10.48 R2.2 | R1.1 28.86,10.22 28.61,10.48 25.05,10.48
N$4
  Top 2.54: Q2.2 47,23.49 43.49,19.98 PV1(+)1.P$1
  Bottom 2.54: Q2.2 47,23.39 43.49,19.88 PV1(+)1.P$1 43.49,19.07 43.34,19.22
N$5
  Top 0.508: M1.J1.6 188.39,69.17 188.47,69.09 R38.2 ZD4.C
N$6
  Top 0.508: Q2.1 42.97,26.65 39.78,23.46 R4.2 39.85,9.97 R3.1
N$7
  Top 2.54: Q3.2 60,22.98 58,20.98 PV1(+)2.P$1
  Bottom 2.54: Q3.2 60,23.18 58.07,21.26 58.07,18.72
N$9
  Top 0.508: Q3.1 56.19,26.65 54.26,24.72 R6.2 54.33,9.97 R5.1
N$10
  Top 2.54: Q4.2 73,22.48 72.51,21.98 PV1(+)3.P$1
  Bottom 2.54: Q4.2 73,22.47 72.3,21.76 72.3,19.22
N$12
  Top 1.27: M1.J2.4 164.85,64.09 163.83,63.07 163.83,52.58 C5.1 164.59,52.58 168.91,48.26 IC1.3
N$13
  Top 0.508: Q4.1 70.46,24.41 68.74,22.69 68.74,9.97 | 68.74,9.97 R8.2 | R7.1 68.74,9.97
N$14
  Top 2.54: Q5.2 86,23.6 87.02,22.59 PV1(+)4.P$1
  Bottom 2.54: Q5.2 86,23.6 87.02,22.59 87.02,18.73 87.03,18.72
N$16
  Top 0.508: Q5.1 83.46,23.18 83.22,22.94 R10.2 83.28,9.72 R9.1
  Bottom 0.508: Q5.1 83.46,27.85
N$17
  Top 2.54: Q6.2 86,80 91.02,85.02 91.02,86.02
  Bottom 2.54: Q6.2 86,80 91.02,85.02 PV1(+)5.P$1
N$19
  Top 0.508: Q6.1 92.91,78.35 95.16,80.6 R12.2 95.09,95.58 R11.1
  Bottom 0.508: Q6.1 88.74,78.15
N$20
  Top 2.54: Q7.2 73,80.49 76.51,84 76.51,86.02
  Bottom 2.54: Q7.2 73,80.49 76.51,84 PV1(+)6.P$1
N$22
  Top 0.508: Q7.1 75.54,78.71 80.17,83.34 80.17,95.52 80.1,95.58 | R13.1 80.1,95.58 | 80.1,95.58 R14.2
N$23
  Top 2.54: Q8.2 60,83.02 62,85.02 PV1(+)7.P$1
  Bottom 2.54: Q8.2 60,83.02 62,85.02 62,86.02
N$25
  Top 0.508: Q8.1 62.54,79.73 65.69,82.88 65.69,95.52 65.63,95.58 | 65.63,95.58 R16.2 | R15.1 65.63,95.58
N$26
  Top 2.54: Q9.2 47,82.51 47.49,83 47.49,86.02
  Bottom 2.54: Q9.2 47,82.51 47.49,83 PV1(+)8.P$1
N$28
  Top 0.508: Q9.1 49.54,81.45 51.21,83.12 51.21,95.52 51.15,95.58 | R17.1 51.15,95.58 | 51.15,95.58 R18.2
  Bottom 0.508: Q9.1 49.54,77.75
N$29
  Top 2.54: PV1(+)9.P$1 32.98,81.4 34,80.38 Q10.2
  Bottom 2.54: PV1(+)9.P$1 32.98,81.4 34,80.38 Q10.2
N$31
  Top 0.508: Q10.1 36.54,83.2 36.74,83.39 36.74,95.3 R20.2 | R19.1 R20.2 | R20.2
  Bottom 0.508: Q10.1 36.54,77.45
N$32  (via drill 0.35)
  Top 0.508: U$2.4 107.19,53.78 | 107.19,53.78 103.19,53.78 103.12,53.85 | U$2.3 111.19,53.78 111.76,54.36 v111.76,54.86 | v107.19,54.86 107.19,53.78
  Top 1.016: R20.1 36.83,97.71 v38.51,99.39 | R18.1 51.21,98.38 v52.23,99.39 | R16.1 65.69,98.38 v66.71,99.39 | R14.1 80.17,98.38 v81.19,99.39 | R12.1 95.16,98.38 96.17,99.39 | R2.1 v27.66,5.91 | R4.1 39.78,6.67 v40.55,5.91 | R6.1 54.26,6.92 v55.28,5.91 | R8.1 68.74,6.92 v69.76,5.91 | R10.1 83.22,6.92 v84.23,5.91 | 96.17,99.39 100.25,99.39 114.3,85.34 114.3,74.68 103.12,63.5 103.12,53.85 103.12,41.15 113.54,30.73 113.54,16.43 102.93,5.83 v92.71,5.83 | 96.17,99.39 92.03,99.39 v91.95,99.31
  Bottom 0.508: v111.76,54.86 v107.19,54.86
  Bottom 1.016: v92.71,5.83 84.31,5.83 v84.23,5.91 v69.76,5.91 55.45,5.91 55.37,5.83 55.36,5.83 v55.28,5.91 v40.55,5.91 v27.66,5.91 | v91.95,99.31 81.27,99.31 v81.19,99.39 v66.71,99.39 v52.23,99.39 v38.51,99.39
N$33
  Top 0.508: U$2.1 111.19,51.88 111.83,51.24 R21.2 114.87,51.24 116.08,50.04 OK1.3
N$34  (via drill 0.35)
  Top 0.508: U$2.5 107.41,50.07 108.02,49.46 C7.1 | OK1.4 109.47,44.96 108.02,46.42 C7.1 | C7.1 106.43,48.01 105.66,48.77 v105.66,49.78 | v105.66,57.4 105.66,58.42 106.17,58.93 110.74,58.93 112.01,57.66 U$1.P$4
  Bottom 0.508: v105.66,49.78 v105.66,57.4
N$36  (via drill 0.35, 0.65)
  Top 0.508: U$5.COIL1 216.15,46.99 D2.C 211.07,41.91 183.39,41.91 | START.2 183.39,10.67 184.91,12.19 R33.2
  Top 1.016: IC4.8 134.87,62.23 134.11,62.99 123.7,62.99 123,63.69 | 123,63.69 C8.2 | U$1.P$2 122.05,62.74 123,63.69 | BATTERY_SOLENOID.1 INDICATOR.1 204.47,18.54 202.44,20.57 D3.C 200.41,26.16 196.85,29.72 187.71,29.72 D1.C 183.13,27.18 176.02,20.07 U$8.COIL1 176.02,12.7 174.5,11.18 159.77,11.18 158.24,12.7 U$8.NO1 | v140.21,36.58 145.54,41.91 160.53,41.91 | v189.48,47.5 189.48,46.74 184.66,41.91 183.39,41.91 160.53,41.91 | IC1.1 163.83,45.21 160.53,41.91 | U$4.P$2 204.72,79.44 206.25,80.96 C9.1
  Top 1.27: v133.86,42.93 v140.21,36.58
  Bottom 0.508: START.2 183.39,11.18 186.44,14.22 197.61,14.22 200.41,17.02 D3.C
  Bottom 1.016: IC4.4 129.79,53.09 131.32,54.61 131.32,59.44 132.59,60.71 IC4.8 | U$3.P$2 203.71,93.41 205.23,91.88 205.23,81.47 203.2,79.44 U$4.P$2 193.8,79.44 189.48,75.12 v189.48,47.5
  Bottom 1.27: 131.32,54.61 131.32,45.47 v133.86,42.93 | v140.21,36.58 145.03,36.58 148.84,32.77 148.84,20.32 154.18,14.99 U$8.NO1
N$37
  Top 0.508: OK1.1 126.24,44.96 126.49,44.7 R22.1
N$38  (via drill 0.35)
  Top 0.508: 138.43,49.53 C1.2 | 132.33,60.71 133.6,59.44 138.3,59.44 | 140.72,50.8 141.73,49.78 ZD1.A | ZD2.A 140.19,65.05 140.72,64.52 R24.A | 125.22,60.71 IC4.1 | OK2.2 193.1,64.71 | 193.1,64.71 193.04,64.77 | 193.1,64.71 191.96,64.71 191.77,64.52
  Top 1.016: 127,60.96 IC4.1 | C8.1 126.49,65.28 v126.87,64.9 | 141.22,10.92 141.48,11.18 | 134.87,9.97 136.14,8.7 136.14,4.06 137.16,3.05 140.21,3.05 141.22,4.06 FAN1.2 | IC2.2 141.48,18.8 140.46,19.81
  Top 1.27: U$3.P$1 192.6,95.95 192.53,96.01 | U$4.P$1 203.9,81.98 204.72,82.8 210.06,82.8 210.75,82.11 C9.2
  Bottom 1.016: IC4.1 127.25,64.52 v126.87,64.9 126.49,65.28
  Bottom 1.27: U$4.P$1 192.85,81.98 192.53,82.3
  pour Top: 100,0 100,199.64 249.94,199.64 193,198.83 193,62 252,62 314,0
  pour Bottom: 100,0 100,199.64 249.94,199.64 193,198.85 193,62 251.94,62 313.94,0
N$39
  Top 0.508: IC4.5 134.87,51.82 135.8,50.89 C1.1
N$40
  Top 1.016: IC2.3 138.94,12.19 138.68,11.94 FAN1.1 | IC2.3 138.94,14.73 | C2.1 136.84,21.84 138.94,19.75 IC2.3
N$41
  Top 0.508: R24.S 143.26,64.52 143.76,65.02 143.76,67.03 ZD2.C
  Bottom 0.508: R24.S 143.26,58.42 141.99,57.15 139.95,57.15 138.43,55.63 IC4.6
N$42  (via drill 0.35)
  Top 0.508: IC4.2 130.3,58.17 131.67,56.79 136.8,56.79 v137.92,57.91 | v141.48,58.93 141.73,58.93 143.26,57.4 R23.S 143.26,53.09 146.33,50.02 ZD1.C
  Bottom 0.508: v137.92,57.91 138.94,58.93 v141.48,58.93
N$43  (via drill 0.35)
  Top 0.508: R25.2 v124.21,39.12
  Bottom 0.508: v124.21,39.12 134.62,39.12 145.8,50.29 R23.E
N$44  (via drill 0.35)
  Top 0.508: R26.2 123.7,33.27 v124.21,32.77
  Bottom 0.508: v124.21,32.77 132.84,32.77 148.84,48.77 148.84,56.01 145.8,59.05 R24.E
N$45
  Top 0.508: ZD5.C 161.82,87.29 R36.2 | R36.2 161.73,83.97 162.05,83.65 162.05,81.68 C6.1 R27.2 | M1.J2.12 165.61,84.41 162.81,87.2 R36.2
N$46
  Top 0.508: R28.1 187.01,79.25 184.55,76.79 M1.J1.9
N$47
  Top 0.508: OK2.1 198.12,70.8 194.31,74.61 194.31,80.52 193.04,81.79 R28.2
N$48
  Top 0.508: OK2.4 210.31,67.25 211.07,68.01 R29.2
  Bottom 0.508: NPN2.B 226.57,89.34 225.55,88.33 225.55,80.2 | PNP1.B 227.33,78.42 225.55,80.2 | OK2.4 208.28,69.79 217.17,69.79 225.55,78.17 225.55,80.2
N$49
  Top 1.016: C11.1 201.23,74.42 U$4.P$4 198.63,74.36 197.1,75.88 197.1,84.77 | C10.1 205.55,90.55 205.23,90.87 U$3.P$3 199.14,90.87 197.1,88.84 197.1,84.77 | 197.1,84.77 CP(2)/PE(1).1
N$50
  Top 0.508: C11.2 209.87,76.39 R31.1
  Top 1.016: U$4.P$3 206.76,76.9 207.33,76.32 C11.2
  Bottom 0.508: OK2.3 204.22,64.71 202.69,66.23 202.69,68.77 204.22,70.29 204.22,75.63 202.95,76.9 U$4.P$3
N$51  (via drill 0.35)
  Top 0.508: C10.2 217.68,88.65 R30.2 218.51,91.82 v218.44,91.88 | R29.1 216.6,70.74 v218.44,72.58
  Top 1.016: U$3.P$4 205.74,88.33 206.06,88.65 C10.2
  Bottom 0.508: v218.44,72.58 v218.44,91.88
N$52
  Top 0.508: PNP1.E 235.2,80.96 235.97,80.2 R32.2
  Bottom 0.508: PNP1.E NPN2.E
N$53
  Top 0.508: R31.2 224.03,76.39 224.54,75.88 PNP1.C
N$54
  Top 0.508: R30.1 222.76,87.82 223.52,88.58 223.52,90.87 224.54,91.88 NPN2.C
N$55
  Top 0.508: R32.1 240.28,80.2 242.32,82.23 CP(2)/PE(1).2
N$56
  Top 2.54: BUS(-).P$1 223.51,10.42 F1.P$4 F1.P$3
N$57
  Top 0.508: NPN3.C 189.23,19.56 186.69,17.02 D1.A 176.02,7.87 U$8.COIL2
N$58
  Top 0.508: 191.77,13.72 191.77,16.26 193.29,17.78 NPN3.B 193.29,21.08 196.09,23.88 NPN4.C | 191.77,13.72 STOP.1 | R33.1 190.25,12.19 191.77,13.72
N$59  (via drill 0.35)
  Top 0.508: R35.2 170.43,24.64 | 170.43,24.64 R34.1 | 170.43,24.64 v170.43,20.07 C13.2
  Bottom 0.508: NPN4.B 188.72,20.07 v170.43,20.07
N$60
  Top 0.508: R34.2 165.87,24.64 164.6,23.37 ZD3.A
N$61
  Top 1.016: C3.1 IC3.3
  Bottom 0.508: START.1 180.85,9.65 178.56,11.94 170.43,11.94 168.4,13.97 U$8.COM1
  Bottom 1.016: IC3.3 170.69,32 167.39,28.7 167.39,16 U$8.COM1
N$62  (via drill 0.35)
  Top 0.508: M1.J2.11 172.47,81.87 175.01,79.33 v175.01,77.8 | v175.01,55.45 175.01,53.09 176.53,51.56 R37.1
  Bottom 0.508: v175.01,77.8 v175.01,55.45
N$63  (via drill 0.35)
  Top 0.508: R22.2 129.47,49.97 130.56,51.05 130.56,54.61 129.54,55.63 IC4.3 | v122.68,75.95 v122.68,98.04 | R36.1 157.99,87.2 v156.5,88.69 156.46,88.73 v156.46,93.73 | R38.1 184.98,72.83 184.82,72.99 182.61,72.99 181.18,74.42 v171.7,74.42
  Bottom 0.508: IC4.3 124.46,55.63 122.68,57.4 v122.68,75.95 | v122.68,98.04 141.22,98.04 145.54,93.73 v156.46,93.73 | v171.7,74.42 171.7,80.77 169.33,83.15 159.42,83.15 156.5,86.07 v156.5,88.69
N$64  (via drill 0.35)
  Top 0.508: R37.2 v211.33,51.56
  Bottom 0.508: v211.33,51.56 211.33,60.2 214.38,63.25 222.9,63.25 225.04,61.1 NPN1.B
N$65
  Top 0.508: D2.A 216.15,54.61 U$5.COIL2 220.22,59.44 221.23,60.45 NPN1.C
N$66
  Bottom 0.508: INVERTER_PWR.2 233.17,59.44 230.38,56.64 230.38,52.07 227.84,49.53 U$5.COM1
N$67
  Top 0.508: INVERTER_PWR.1 237.24,61.98 235.46,60.2 235.46,51.82 238,49.28 U$5.NO1

### Text on the board
tPlace: Solarpunk Controller 24-Volt V1.1 | Tesla Current Controller | PV10 PV9 PV8 PV7 PV6 | Inputs: | PV Output / Bang-Bang Pass / Regulator | Top-Setpoint | 1kHz / "Basic Signalling" | +VBat | Bottom- / Setpoint | OUT | Plant Trip Control | -Manual Start / -Manual Trip / -Trips if VBat>30V | 5A Fuse | Inputs: | PV1 PV2 PV3 PV4 PV5 | BUS (-)